# EAGLE design pga309 z bluetooth (EAGLE 5.06)

## Sheet 1 of 2
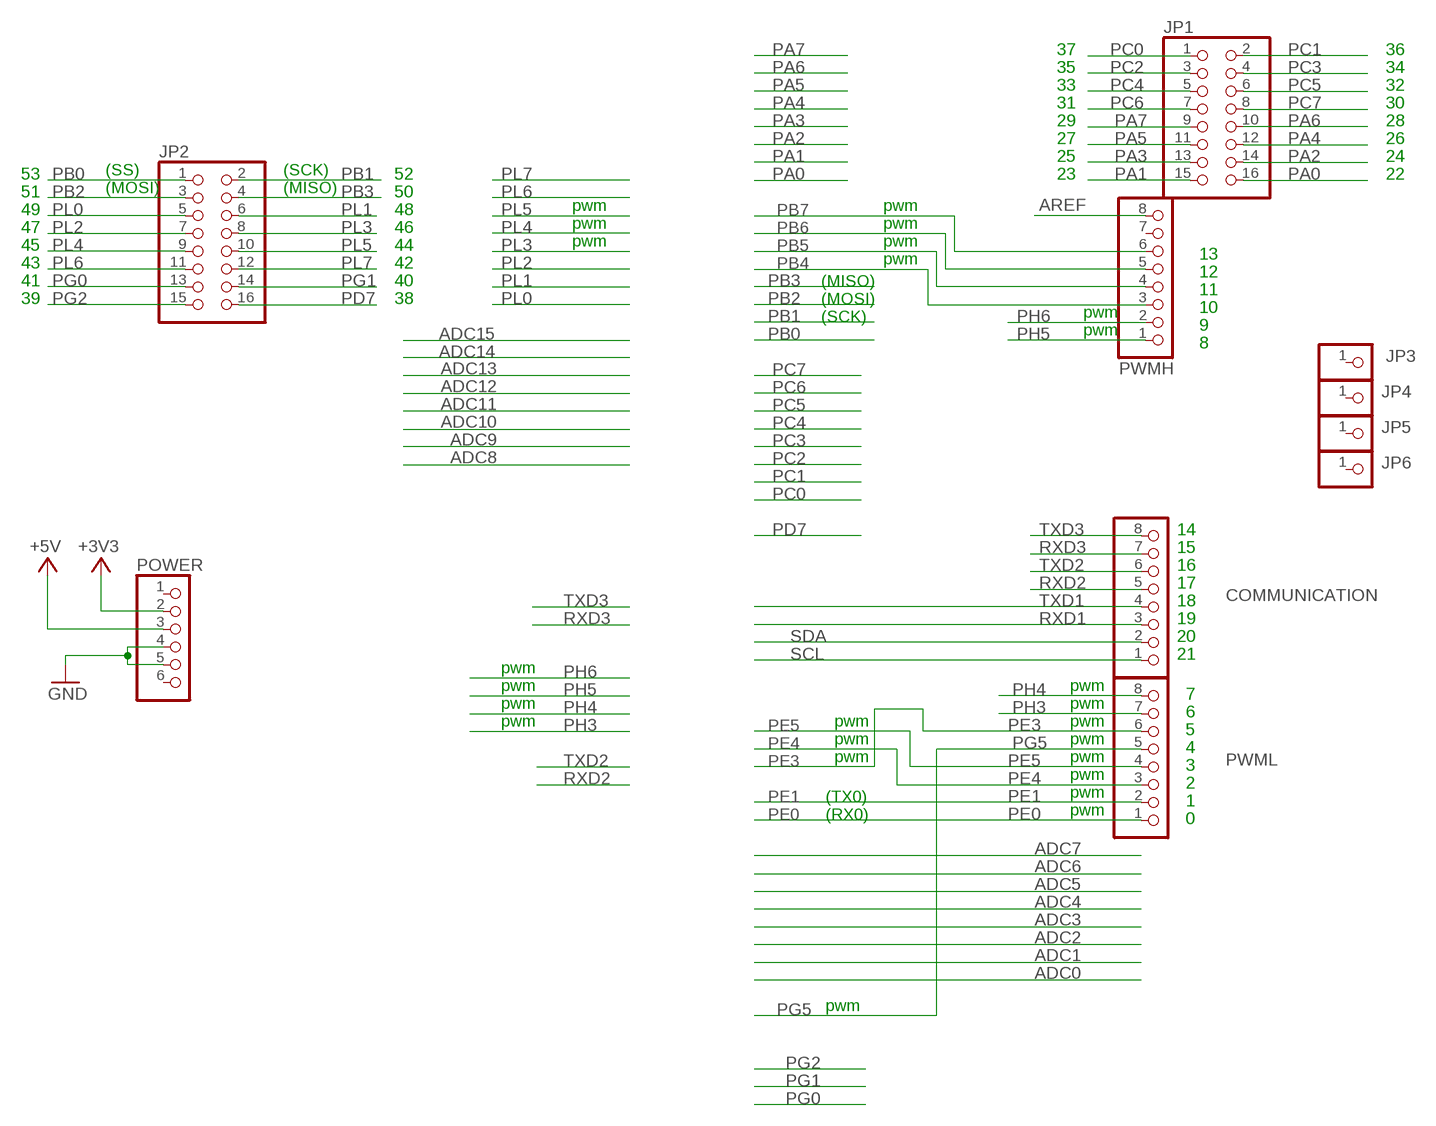
[diagram p0: schematic, sheet 1]

### Parts
COMMUNICATION  PINHD-1X8  [1X08]
JP1  PINHD-2X8  [2X08]
JP2  PINHD-2X8  [2X08]
JP3  PINHD-1X1  [1X01]
JP4  PINHD-1X1  [1X01]
JP5  PINHD-1X1  [1X01]
JP6  PINHD-1X1  [1X01]
POWER  PINHD-1X6  [1X06]
PWMH  PINHD-1X8  [1X08]
PWML  PINHD-1X8  [1X08]

### Nets
+3V3 [power]: POWER.2 ; also sheet 2
AREF: PWMH.8
GND [gnd]: POWER.4 POWER.5 ; also sheet 2
N$25: POWER.3 ; supply symbol labelled +5V ; also sheet 2
PA0: JP1.16
PA1: JP1.15
PA2: JP1.14
PA3: JP1.13
PA4: JP1.12
PA5: JP1.11
PA6: JP1.10
PA7: JP1.9
PB0: JP2.1
PB1: JP2.2 ; also sheet 2
PB2: JP2.3
PB3: JP2.4 ; also sheet 2
PB4: PWMH.3
PB5: PWMH.4
PB6: PWMH.5
PB7: PWMH.6
PC0: JP1.1
PC1: JP1.2
PC2: JP1.3
PC3: JP1.4
PC4: JP1.5
PC5: JP1.6
PC6: JP1.7
PC7: JP1.8
PD7: JP2.16
PE0: PWML.1
PE1: PWML.2
PE3: PWML.6
PE4: PWML.3
PE5: PWML.4
PG0: JP2.13
PG1: JP2.14
PG2: JP2.15
PG5: PWML.5
PH3: PWML.7
PH4: PWML.8
PH5: PWMH.1
PH6: PWMH.2
PL0: JP2.5
PL1: JP2.6 ; also sheet 2
PL2: JP2.7
PL3: JP2.8
PL4: JP2.9
PL5: JP2.10
PL6: JP2.11
PL7: JP2.12
RXD1: COMMUNICATION.3 ; also sheet 2
RXD2: COMMUNICATION.5
RXD3: COMMUNICATION.7
SCL: COMMUNICATION.1 ; also sheet 2
SDA: COMMUNICATION.2 ; also sheet 2
TXD1: COMMUNICATION.4 ; also sheet 2
TXD2: COMMUNICATION.6
TXD3: COMMUNICATION.8
Unconnected: JP3.1 JP4.1 JP5.1 JP6.1 POWER.1 POWER.6 PWMH.7

### Notes on the sheet
- 37 | 36
- 35 | 34
- 33 | 32
- 31 | 30
- 29 | 28
- 27 | 26
- 25 | 24
- 53 | (SS) | (SCK) | 52 | 23 | 22
- 51 | (MOSI) | (MISO) | 50
- 49 | 48 | pwm | pwm
- 47 | 46 | pwm | pwm
- 45 | 44 | pwm | pwm
- pwm | 13
- 43 | 42
- 12
- 41 | 40 | (MISO)
- 11
- 39 | 38 | (MOSI)
- pwm | 10
- (SCK)
- pwm | 9
- 8
- 14
- 15
- 16
- 17
- 18
- 19
- 20
- 21
- pwm
- pwm | pwm
- 7
- pwm | pwm
- 6
- pwm | pwm | pwm
- 5
- pwm | pwm
- 4
- pwm | pwm
- 3
- pwm
- 2
- (TX0) | pwm
- 1
- (RX0) | pwm
- 0
- pwm

## Sheet 2 of 2
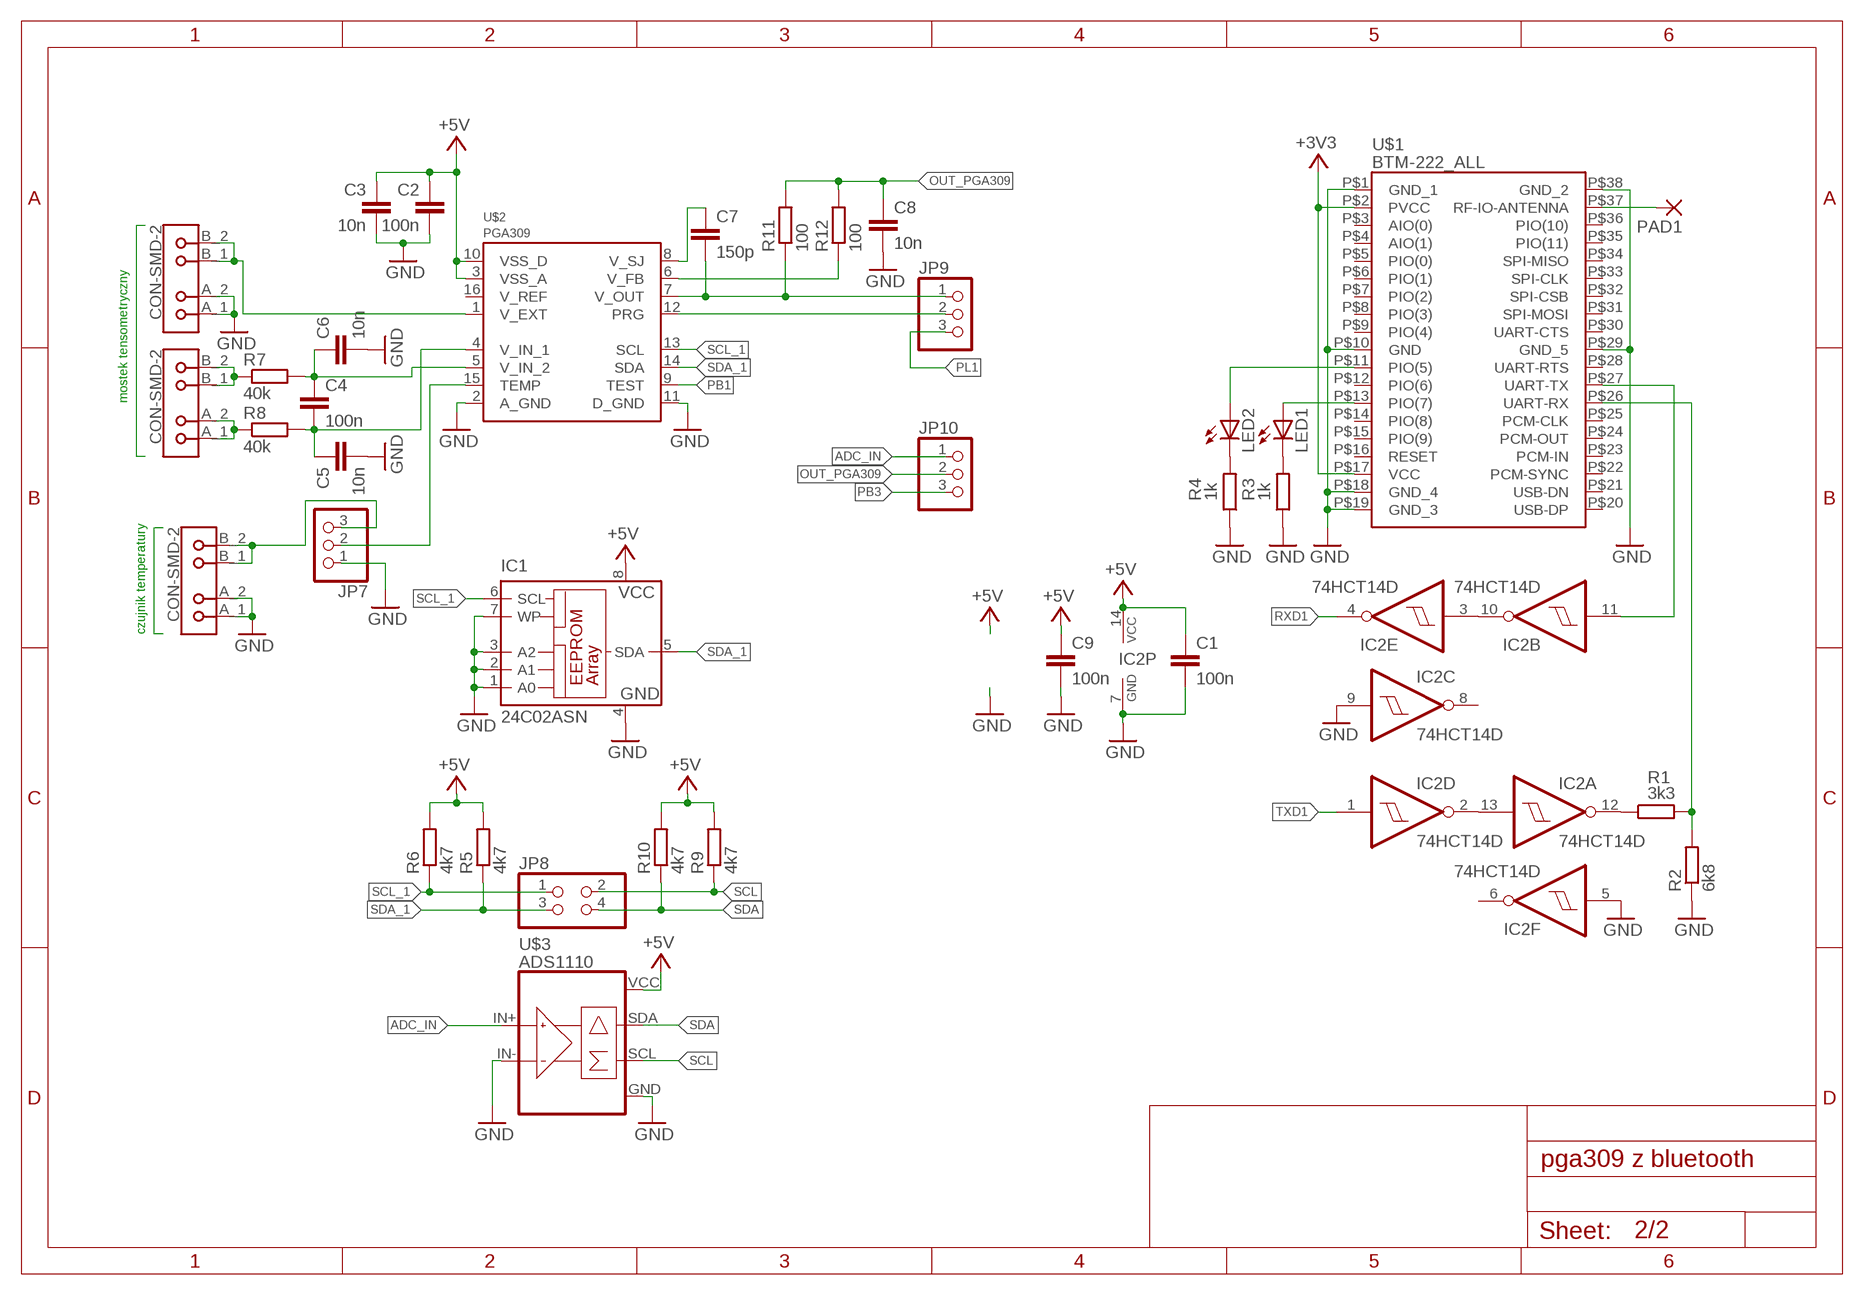
[diagram p1: schematic, sheet 2]

### Parts
C1  100n  C-EUC0805  [C0805]
C2  100n  C-EUC0805  [C0805]
C3  10n  C-EUC0805  [C0805]
C4  100n  C-EUC0805  [C0805]
C5  10n  C-EUC0805  [C0805]
C6  10n  C-EUC0805  [C0805]
C7  150p  C-EUC1206  [C1206]
C8  10n  C-EUC0805  [C0805]
C9  100n  C-EUC0805  [C0805]
IC1  24C02ASN  [SO-08]
IC2  74HCT14D  74AC14D  [SO14]
JP7  PINHD-1X3_2.54-SMD  [1X03SMD]
JP8  PINHD-2X2_2.54-SMD  [2X02SMD]
JP9  PINHD-1X3_2.54-SMD  [1X03SMD]
JP10  PINHD-1X3_2.54-SMD  [1X03SMD]
LED1  LEDCHIPLED_0805  [CHIPLED_0805]
LED2  LEDCHIPLED_0805  [CHIPLED_0805]
PAD1  SMD2  [SMD1,27-2,54]
R1  3k3  R-EU_R0805  [R0805]
R2  6k8  R-EU_R0805  [R0805]
R3  1k  R-EU_R0805  [R0805]
R4  1k  R-EU_R0805  [R0805]
R5  4k7  R-EU_R0805  [R0805]
R6  4k7  R-EU_R0805  [R0805]
R7  40k  R-EU_R1206  [R1206]
R8  40k  R-EU_R1206  [R1206]
R9  4k7  R-EU_R0805  [R0805]
R10  4k7  R-EU_R0805  [R0805]
R11  100  R-EU_R1206  [R1206]
R12  100  R-EU_R1206  [R1206]
U$1  BTM-222_ALL  [BTM-222]
U$2  PGA309  [TSSOP16]
U$3  ADS1110  [SOT23-6]
U$4  CON-SMD-2  [CON-SMD_2_PIN]
U$5  CON-SMD-2  [CON-SMD_2_PIN]
U$6  CON-SMD-2  [CON-SMD_2_PIN]

### Nets
+3V3 [power]: U$1.P$2(PVCC) U$1.P$17(VCC) ; also sheet 1
ADC_IN: JP10.1 U$3.IN+
GND [gnd]: C1.2 C2.2 C3.2 C5.2 C6.2 C8.2 C9.2 IC1.1(A0) IC1.2(A1) IC1.3(A2) IC1.4(GND) IC1.7(WP) IC2.5(F:I) IC2.7(P:GND) IC2.9(C:I) JP7.1 R2.1 R3.1 R4.1 U$1.P$1(GND_1) U$1.P$10(GND) U$1.P$18(GND_4) U$1.P$19(GND_3) U$1.P$29(GND_5) U$1.P$38(GND_2) U$2.2(A_GND) U$2.11(D_GND) U$3.GND U$3.IN- U$4.A_1 U$4.A_2 U$6.A_1 U$6.A_2 ; also sheet 1
N$2: IC2.2(D:O) IC2.13(A:I)
N$4: IC2.3(E:I) IC2.10(B:O)
N$6: R7.1 U$5.B_1 U$5.B_2
N$7: IC2.12(A:O) R1.1
N$8: PAD1.1(P) U$1.P$37(RF-IO-ANTENNA)
N$9: LED1.A U$1.P$13(PIO(7))
N$10: LED2.A U$1.P$11(PIO(5))
N$11: LED1.C R3.2
N$12: LED2.C R4.2
N$13: R8.1 U$5.A_1 U$5.A_2
N$16: JP7.2 U$2.15(TEMP)
N$17: U$2.1(V_EXT) U$4.B_1 U$4.B_2
N$18: C4.2 C5.1 R8.2 U$2.4(V_IN_1)
N$19: C4.1 C6.1 R7.2 U$2.5(V_IN_2)
N$20: C7.2 JP9.1 R11.1 U$2.7(V_OUT)
N$21: JP7.3 U$6.B_1 U$6.B_2
N$22: JP9.2 U$2.12(PRG)
N$23: C7.1 U$2.8(V_SJ)
N$24: R12.1 U$2.6(V_FB)
N$25: C1.1 C2.1 C3.1 C9.1 IC1.8(VCC) IC2.14(P:VCC) R5.2 R6.2 R9.2 R10.2 U$2.3(VSS_A) U$2.10(VSS_D) U$3.VCC ; supply symbol labelled +5V ; also sheet 1
OUT_PGA309: C8.1 JP10.2 R11.2 R12.2
PB1: U$2.9(TEST) ; also sheet 1
PB3: JP10.3 ; also sheet 1
PL1: JP9.3 ; also sheet 1
RXD1: IC2.4(E:O) ; also sheet 1
SCL: JP8.2 R9.1 U$3.SCL ; also sheet 1
SCL_1: IC1.6(SCL) JP8.1 R6.1 U$2.13(SCL)
SDA: JP8.4 R10.1 U$3.SDA ; also sheet 1
SDA_1: IC1.5(SDA) JP8.3 R5.1 U$2.14(SDA)
TXD1: IC2.1(D:I) ; also sheet 1
UART-RX: R1.2 R2.2 U$1.P$26(UART-RX)
UART-TX: IC2.11(B:I) U$1.P$27(UART-TX)
Unconnected: IC2.6(F:O) IC2.8(C:O) U$1.P$3(AIO(0)) U$1.P$4(AIO(1)) U$1.P$5(PIO(0)) U$1.P$6(PIO(1)) U$1.P$7(PIO(2)) U$1.P$8(PIO(3)) U$1.P$9(PIO(4)) U$1.P$12(PIO(6)) U$1.P$14(PIO(8)) U$1.P$15(PIO(9)) U$1.P$16(RESET) U$1.P$20(USB-DP) U$1.P$21(USB-DN) U$1.P$22(PCM-SYNC) U$1.P$23(PCM-IN) U$1.P$24(PCM-OUT) U$1.P$25(PCM-CLK) U$1.P$28(UART-RTS) U$1.P$30(UART-CTS) U$1.P$31(SPI-MOSI) U$1.P$32(SPI-CSB) U$1.P$33(SPI-CLK) U$1.P$34(SPI-MISO) U$1.P$35(PIO(11)) U$1.P$36(PIO(10)) U$2.16(V_REF)

### Notes on the sheet
- mostek tensometryczny
- czujnik temperatury

## Library data of the parts
C1-C9 = rcl:C-EU: CAPACITOR, European symbol
COMMUNICATION PWMH PWML = pinhead:PINHD-1X8: PIN HEADER
IC1 = microchip:24C*: Serial EEPROM 1 K/2 K/4 K
IC2 = 74xx-eu:74*14: Hex schmitt trigger INVERTER
JP1 JP2 = pinhead:PINHD-2X8: PIN HEADER
JP3-JP6 = pinhead:PINHD-1X1: PIN HEADER
JP7 JP9 JP10 = pinhead-1:PINHD-1X3: PIN HEADER
JP8 = pinhead-1:PINHD-2X2: PIN HEADER
LED1 LED2 = led:LED: LED OSRAM: - CHIPLED LG R971, LG N971, LY N971, LG Q971, LY Q971, LO R971, LY R971 LH N974, LH R974 LS Q976, LO Q976, LY Q976 LO Q996 - Hyper CHIPLED LW Q18S LB Q993, LB Q99A, LB R99A - SideLED LS A670, LO A670, LY A670, LG A670, LP A670 LB A673, LV A673, LT A673, LW A673 LH A674 LY A675 LS A676, LA A676, LO A676, LY A676, LW A676 LS A679, LY A679, LG A679 - Hyper Micro SIDELED® LS Y876, LA Y876, LO Y876, LY Y876 LT Y87S - SmartLED LW L88C, LW L88S LB L89C, LB L89S, LG L890 LS L89K, LO L89K, LY L89K LS L896, LA L896, LO L896, LY L896 - TOPLED LS T670, LO T670, LY T670, LG T670, LP T670 LSG T670, LSP T670, LSY T670, LOP T670, LYG T670 LG T671, LOG T671, LSG T671 LB T673, LV T673, LT T673, LW T673 LH T674 LS T676, LA T676, LO T676, LY T676, LB T676, LH T676, LSB T676, LW T676 LB T67C, LV T67C, LT T67C, LS T67K, LO T67K, LY T67K, LW E67C LS E67B, LA E67B, LO E67B, LY E67B, LB E67C, LV E67C, LT E67C LW T67C LS T679, LY T679, LG T679 LS T770, LO T770, LY T770, LG T770, LP T770 LB T773, LV T773, LT T773, LW T773 LH T774 LS E675, LA E675, LY E675, LS T675 LS T776, LA T776, LO T776, LY T776, LB T776 LHGB T686 LT T68C, LB T68C - Hyper Mini TOPLED® LB M676 - Mini TOPLED Santana® LG M470 LS M47K, LO M47K, LY M47K Source: http://www.osram.convergy.de LUXEON: - LUMILED® LXK2-PW12-R00, LXK2-PW12-S00, LXK2-PW14-U00, LXK2-PW14-V00 LXK2-PM12-R00, LXK2-PM12-S00, LXK2-PM14-U00 LXK2-PE12-Q00, LXK2-PE12-R00, LXK2-PE12-S00, LXK2-PE14-T00, LXK2-PE14-U00 LXK2-PB12-K00, LXK2-PB12-L00, LXK2-PB12-M00, LXK2-PB14-N00, LXK2-PB14-P00, LXK2-PB14-Q00 LXK2-PR12-L00, LXK2-PR12-M00, LXK2-PR14-Q00, LXK2-PR14-R00 LXK2-PD12-Q00, LXK2-PD12-R00, LXK2-PD12-S00 LXK2-PH12-R00, LXK2-PH12-S00 LXK2-PL12-P00, LXK2-PL12-Q00, LXK2-PL12-R00 Source: www.luxeon.com KINGBRIGHT: KA-3528ASYC Source: www.kingbright.com
PAD1 = wirepad:SMD2: SMD PAD
POWER = pinhead:PINHD-1X6: PIN HEADER
R1-R12 = rcl:R-EU_: RESISTOR, European symbol
U$1 = BTM_222:BTM-222_ALL
U$2 = pga309:PGA309
U$3 = ads1110:ADS1110
U$4-U$6 = con-smd-2:CON-SMD-2

## Net classes
0 default: width 0.203 mm, drill 0.406 mm, clearance 0.203 mm
1 power: width 0.61 mm, drill 0.711 mm, clearance 0.203 mm
2 gnd: width 0.305 mm, drill 0.711 mm, clearance 0.203 mm
3 usbvcc: width 0.508 mm, drill 0.711 mm, clearance 0.203 mm

## Board
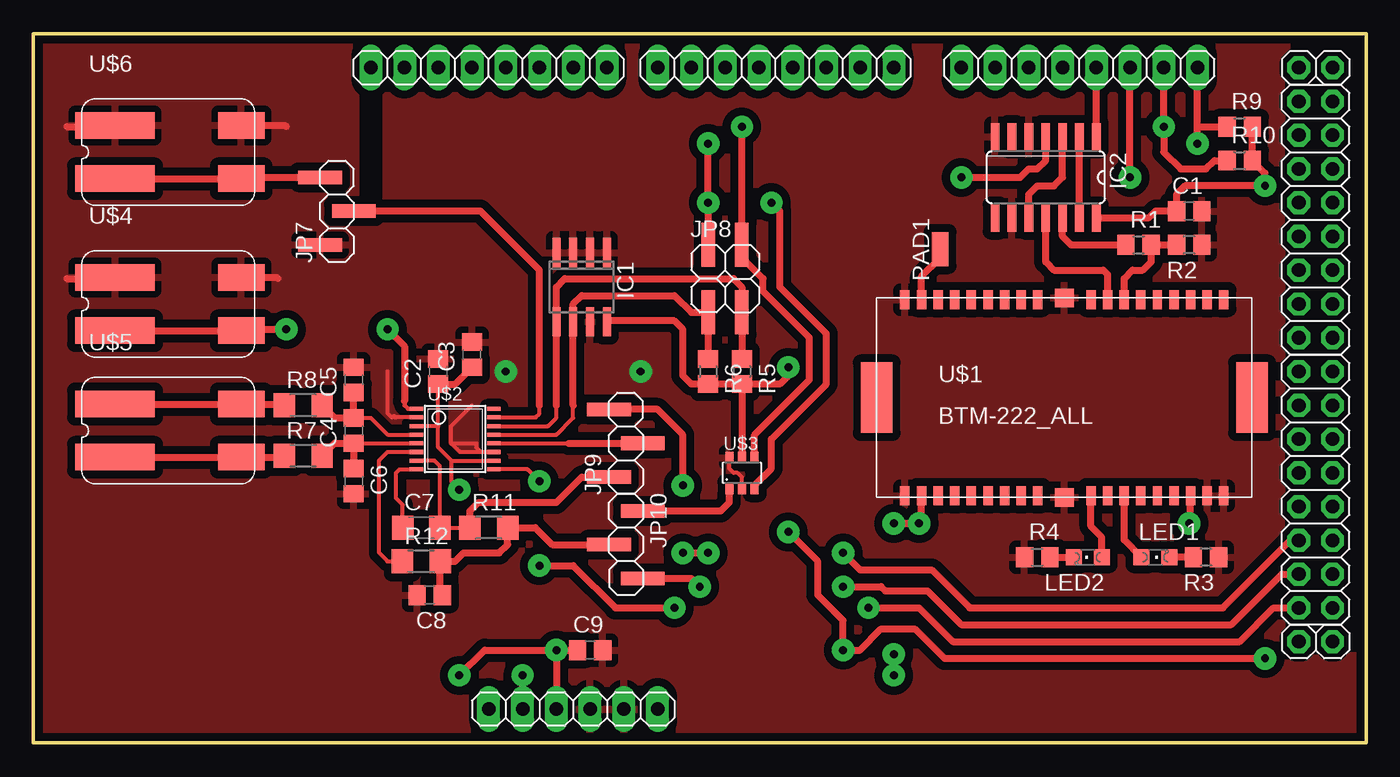
[diagram p2: board, top side]
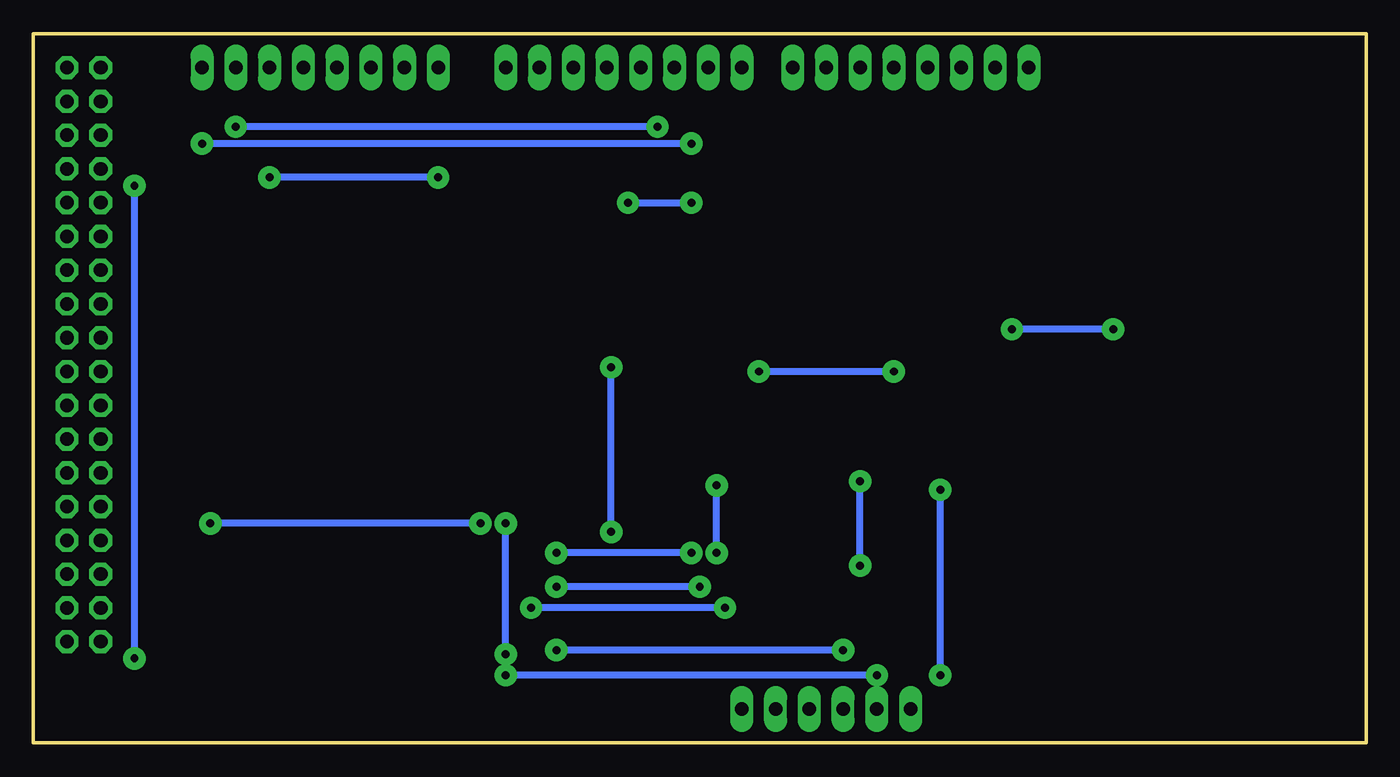
[diagram p3: board, bottom side, seen from below]

Size 100.33 x 53.34 mm. Coordinates in mm from the lower left corner, seen from the top.
Outline: 0,53.34 100.33,53.34 100.33,0 0,0 0,53.34
Copper layers (1*16): Top 0.035mm / dielectric 1.5mm / Bottom 0.035mm
Design rules "default *": minimum track width 8mil, minimum drill 16mil, track to track 8mil, track to pad 8mil, pad to pad 8mil, via to via 10mil, smd to smd 8mil, copper to edge 20mil, drill to drill 12mil, minimum pad ring 14mil, minimum via ring 10mil, stop-mask expansion 4mil, vias tented up to drill 0mil, thermal gap 20mil
tRestrict: 4 lines

### Footprints (pad centres in the part's own frame; a part is rotated, then mirrored left to right if it is on the bottom)
C0805 = smd 1.3 x 1.5: 1 -0.95,0; 2 0.95,0
C1206 = smd 1.6 x 1.8: 1 -1.4,0; 2 1.4,0
1X08 = drill 1.016 long: 1 -8.89,0; 2 -6.35,0; 3 -3.81,0; 4 -1.27,0; 5 1.27,0; 6 3.81,0; 7 6.35,0; 8 8.89,0
SO-08 = smd 0.6 x 2.2: 1 -1.905,-2.6; 2 -0.635,-2.6; 3 0.635,-2.6; 4 1.905,-2.6; 5 1.905,2.6; 6 0.635,2.6; 7 -0.635,2.6; 8 -1.905,2.6
SO14 = smd 0.66 x 2.032: 1 -3.81,-3.073; 2 -2.54,-3.073; 3 -1.27,-3.073; 4 0,-3.073; 5 1.27,-3.073; 6 2.54,-3.073; 7 3.81,-3.073; 8 3.81,3.073; 9 2.54,3.073; 10 1.27,3.073; 11 0,3.073; 12 -1.27,3.073; 13 -2.54,3.073; 14 -3.81,3.073
2X08 = drill 1.016 octagon: 1 -8.89,-1.27; 2 -8.89,1.27; 3 -6.35,-1.27; 4 -6.35,1.27; 5 -3.81,-1.27; 6 -3.81,1.27; 7 -1.27,-1.27; 8 -1.27,1.27; 9 1.27,-1.27; 10 1.27,1.27; 11 3.81,-1.27; 12 3.81,1.27; 13 6.35,-1.27; 14 6.35,1.27; 15 8.89,-1.27; 16 8.89,1.27
1X01 = drill 1.016 octagon: 1 0,0
1X03SMD = smd 1.016 x 3.302: 1 -1.27,1.27; 2 1.27,-1.27; 3 3.81,1.27
2X02SMD = smd 1.016 x 3.302: 1 -1.27,-3.81; 2 -1.27,1.27; 3 1.27,-3.81; 4 1.27,1.27
CHIPLED_0805 = smd 1.2 x 1.2: A 0,-1.05; C 0,1.05
SMD1,27-2,54 = smd 1.27 x 2.54: 1 0,0
1X06 = drill 1.016 long: 1 -6.35,0; 2 -3.81,0; 3 -1.27,0; 4 1.27,0; 5 3.81,0; 6 6.35,0
R0805 = smd 1.3 x 1.5: 1 -0.95,0; 2 0.95,0
R1206 = smd 1.6 x 1.803: 1 -1.422,0; 2 1.422,0
BTM-222 = smd 2.4 x 5.3: $AGND -14.625,3.75; $BGND 13.625,3.75 | smd 0.711 x 1.422: P$1 -12.5,-3.625; P$2 -11.25,-3.625; P$3 -10,-3.625; P$4 -8.75,-3.625; P$5 -7.5,-3.625; P$6 -6.25,-3.625; P$7 -5,-3.625; P$8 -3.75,-3.625; P$9 -2.5,-3.625; P$11 1.5,-3.625; P$12 2.75,-3.625; P$13 4,-3.625; P$14 5.25,-3.625; P$15 6.5,-3.625; P$16 7.75,-3.625; P$17 9,-3.625; P$18 10.25,-3.625; P$19 11.5,-3.625; P$20 11.5,11.125; P$21 10.25,11.125; P$22 9,11.125; P$23 7.75,11.125; P$24 6.5,11.125; P$25 5.25,11.125; P$26 4,11.125; P$27 2.75,11.125; P$28 1.5,11.125; P$30 -2.5,11.125; P$31 -3.75,11.125; P$32 -5,11.125; P$33 -6.25,11.125; P$34 -7.5,11.125; P$35 -8.75,11.125; P$36 -10,11.125; P$37 -11.25,11.125; P$38 -12.5,11.125 | smd 1.422 x 1.4: P$10 -0.5,-3.75; P$29 -0.5,11.25
TSSOP16 = smd 0.305 x 0.991: 1 -2.275,-2.918; 2 -1.625,-2.918; 3 -0.975,-2.918; 4 -0.325,-2.918; 5 0.325,-2.918; 6 0.975,-2.918; 7 1.625,-2.918; 8 2.275,-2.918; 9 2.275,2.918; 10 1.625,2.918; 11 0.975,2.918; 12 0.325,2.918; 13 -0.325,2.918; 14 -0.975,2.918; 15 -1.625,2.918; 16 -2.275,2.918
SOT23-6 = smd 0.6 x 0.9: GND 0,-1.15; IN+ -0.95,-1.15; IN- -0.95,1.15; SCL 0.95,-1.15; SDA 0.95,1.15; VCC 0,1.15
CON-SMD_2_PIN = smd 6 x 2: A_1 -4,2; B_1 -4,-2 | smd 3.5 x 2: A_2 5.5,2; B_2 5.5,-2

### Placement (x,y rotation side)
C1  86.99,40.01 0 top
C2  30.48,27.94 90 top
C3  33.02,29.21 90 top
C4  24.13,23.5 90 top
C5  24.13,27.3 90 top
C6  24.13,19.68 270 top
C7  29.21,16.19 0 top
C8  29.84,11.11 180 top
C9  41.91,6.99 0 top
COMMUNICATION  78.74,50.8 180 top
IC1  41.28,34.29 180 top
IC2  76.2,42.55 180 top
JP1  96.52,39.37 90 top
JP2  96.52,19.05 90 top
JP3  95.25,50.8 0 top
JP4  97.79,50.8 0 top
JP5  95.25,7.62 0 top
JP6  97.79,7.62 0 top
JP7  22.86,38.73 90 top
JP8  52.07,36.2 0 top
JP9  44.61,21.27 90 top
JP10  44.61,16.19 270 top
LED1  84.45,13.97 270 top
LED2  79.38,13.97 90 top
PAD1  68.26,37.15 0 top
POWER  40.64,2.54 0 top
PWMH  34.29,50.8 180 top
PWML  55.88,50.8 180 top
R1  83.19,37.47 0 top
R2  86.99,37.47 180 top
R3  88.27,13.97 180 top
R4  75.56,13.97 0 top
R5  53.34,27.94 270 top
R6  50.8,27.94 270 top
R7  20.32,21.59 0 top
R8  20.32,25.4 0 top
R9  90.8,46.35 0 top
R10  90.8,43.81 0 top
R11  34.29,16.19 0 top
R12  29.21,13.65 0 top
U$1  78.1,22.23 0 top
U$2  31.75,22.86 270 top
U$3  53.34,20.32 0 top
U$4  10.16,33.02 0 top
U$5  10.16,23.5 0 top
U$6  10.16,44.45 0 top

### Tracks (layer width: path | path; a pad name or v marks a point on that pad's centre or on a via)
+3V3  (via drill 0.6 pad 1.68)
  Top 0.508: U$1.P$2 66.85,16.69 v66.67,16.51 v64.77,16.51 | v86.99,16.51 87.1,16.62 U$1.P$17 | POWER.2 v36.83,5.08 | v64.77,5.08 v64.77,6.67
  Bottom 0.508: v66.67,16.51 v86.99,16.51 | v36.83,5.08 v64.77,5.08 | v64.77,6.67 v64.77,16.51
ADC_IN
  Top 0.508: JP10.1 51.75,17.46 52.39,18.1 U$3.IN+
GND  (via drill 0.6 pad 1.68)
  Top 0.305: 27.15,24.61 27.27,24.48 U$2.2 26.99,24.48 26.67,24.8 26.67,27.94 | U$3.GND 53.34,20 53.02,20.32 52.71,20.32 52.39,20.64 U$3.IN- | U$2.11 32.09,21.89 31.43,22.54 | 31.43,22.54 33.34,22.54 33.34,22.23 33.66,21.91 | 31.43,22.54 31.43,23.81 33.02,25.4
  Top 0.508: U$4.A_2 18.32,35.02 18.41,34.92 | U$6.A_2 18.95,46.45 19.05,46.35 | 2.54,34.92 5.71,34.92 6.35,35.56 | 2.54,46.35 5.71,46.35
  Bottom 0.508: v35.56,27.94 v45.72,27.94
  pour Top (isolate 0.61): 100.33,0 100.33,53.34 0,53.34 0,0
N$2
  Top 0.508: IC2.13 IC2.2
N$4
  Top 0.508: IC2.10 74.93,41.27 75.56,41.91 76.83,41.91 77.47,42.55 IC2.3
N$6
  Top 0.508: U$5.B_1 U$5.B_2 18.8,21.5 R7.1
N$7
  Top 0.508: R1.1 78.1,37.47 77.47,38.1 IC2.12
N$8
  Top 0.508: U$1.P$37 66.85,35.1 68.26,36.51 PAD1.1
N$9
  Top 0.508: U$1.P$13 82.1,15.27 LED1.A
N$10
  Top 0.508: U$1.P$11 79.6,16.28 80.42,15.46 LED2.A
N$11
  Top 0.508: R3.2 LED1.C
N$12
  Top 0.508: R4.2 LED2.C
N$13
  Top 0.508: U$5.A_1 U$5.A_2 | U$5.A_2 16.41,25.5 16.51,25.4 15.24,25.4 | U$5.A_2 18.8,25.5 R8.1
N$16
  Top 0.305: U$2.15 37.82,24.48 38.1,24.77 38.1,25.4
  Top 0.508: 38.1,25.4 38.1,35.56 33.66,40.01 JP7.2
N$17  (via drill 0.6 pad 1.68)
  Top 0.305: U$2.1 28.2,25.14 27.94,25.4 27.94,25.72
  Top 0.508: U$4.B_1 U$4.B_2 15.75,31.11 v19.05,31.11 | v26.67,31.11 27.94,29.84 27.94,25.72
  Bottom 0.508: v19.05,31.11 v26.67,31.11
N$18
  Top 0.305: U$2.4 26.66,23.18 25.4,24.45 C4.2
  Top 0.508: R8.2 22.7,24.45 C4.2 C5.1
N$19
  Top 0.305: U$2.5 24.14,22.54 C4.1
  Top 0.508: R7.2 22.7,22.55 C4.1 C6.1
N$20
  Top 0.305: U$2.7 30.2,21.23 30.61,20.82 C7.2 R11.1
  Top 0.508: JP9.1 41.28,20 39.37,18.1 33.5,18.1 32.87,17.46 R11.1
N$21
  Top 0.508: U$6.B_1 U$6.B_2 15.75,42.55 JP7.3
N$22
  Top 0.305: U$2.12 40.32,22.54
  Top 0.508: 40.32,22.54 JP9.2 | JP9.2
N$23
  Top 0.305: U$2.8 27.57,20.59 27.3,20.32 27.3,18.41 27.81,17.91 C7.1
N$24
  Top 0.305: U$2.6 26.67,21.89 26.04,21.25 26.04,14.29 26.67,13.65 R12.1
N$25  (via drill 0.6 pad 1.68)
  Top 0.305: 30.48,23.84 U$2.3 | 30.48,23.84 C2.1 | 31.47,21.23 30.48,22.23 30.48,23.84 | 31.47,21.23 31.47,19.65 v32.07,19.05 | 31.47,21.23 U$2.10
  Top 0.508: R9.2 R10.2 92.71,42.86 v92.71,41.91 86.68,41.91 86.05,41.27 C1.1 84.45,40.01 83.92,39.47 IC2.14 | v39.37,6.99 POWER.3 | v92.71,6.35 68.58,6.35 66.36,8.57 63.82,8.57 62.23,6.99 v60.96,6.99 60.96,9.21 59.05,11.11 59.05,13.65 v56.83,15.88 | R5.2 R6.2 49.53,26.99 48.9,27.62 48.9,31.11 48.26,31.75 43.24,31.75 IC1.8 | R5.2 | C2.1 31.75,26.99 C3.1 | R5.2 U$3.VCC | v56.83,28.26 56.83,27.62 56.2,26.99 R5.2 | v39.37,6.99 33.97,6.99 v32.07,5.08 | v39.37,6.99 C9.1
  Bottom 0.508: v92.71,6.35 v92.71,41.91 | v39.37,6.99 v60.96,6.99 | v32.07,5.08 v32.07,19.05 | v56.83,15.88 v56.83,28.26
OUT_PGA309
  Top 0.508: C8.1 30.63,11.28 R12.2 31.75,13.65 32.38,14.29 35.08,14.29 35.71,14.92 R11.2 | R11.2 35.56,16.04 | JP10.2 39.05,14.92 37.78,16.19 R11.2
PB1  (via drill 0.6 pad 1.68)
  Top 0.305: U$2.9 37.2,20.59 v38.1,19.68
  Top 0.508: JP2.2 93.34,10.16 90.8,7.62 69.21,7.62 66.67,10.16 v62.87,10.16 | v38.1,13.34 40.64,13.34 43.82,10.16 v48.26,10.16
  Bottom 0.508: v38.1,13.34 v38.1,19.68 | v48.26,10.16 v62.87,10.16
PB3  (via drill 0.6 pad 1.68)
  Top 0.508: JP2.4 93.98,12.7 90.17,8.89 69.85,8.89 67.31,11.43 64.14,11.43 63.82,11.75 v60.96,11.75 | v50.17,11.75 49.53,12.38 JP10.3
  Bottom 0.508: v50.17,11.75 v60.96,11.75
PL1  (via drill 0.6 pad 1.68)
  Top 0.508: JP2.6 94.61,15.24 89.53,10.16 70.48,10.16 67.63,13.02 62.23,13.02 v60.96,14.29 | JP9.3 46.99,25.08 48.9,23.18 v48.9,19.37 | v48.9,14.29 v50.8,14.29
  Bottom 0.508: v48.9,14.29 v48.9,19.37 | v50.8,14.29 v60.96,14.29
RXD1  (via drill 0.6 pad 1.68)
  Top 0.508: IC2.4 76.2,43.81 75.56,43.18 74.93,43.18 74.3,42.55 v69.85,42.55 | v82.55,42.55 COMMUNICATION.3
  Bottom 0.508: v69.85,42.55 v82.55,42.55
SCL  (via drill 0.6 pad 1.68)
  Top 0.508: v50.8,45.09 v50.8,40.64 JP8.2 | 87.63,46.35 R9.1 | 87.63,46.35 COMMUNICATION.1 | v87.63,45.09 87.63,46.35 | U$3.SCL 54.29,19.36 55.56,20.64 55.56,22.86 59.69,26.99 59.69,30.8 56.2,34.29 56.2,40.01 v55.56,40.64
  Bottom 0.508: v50.8,45.09 v87.63,45.09 | v55.56,40.64 v50.8,40.64
SCL_1
  Top 0.305: U$2.13 39.37,23.18 40.64,24.45 40.64,25.4
  Top 0.508: R6.1 JP8.1 49.53,32.38 48.26,33.66 41.28,33.66 40.64,33.02 IC1.6 40.64,25.4
SDA  (via drill 0.6 pad 1.68)
  Top 0.508: COMMUNICATION.2 v85.09,46.35 85.09,44.45 86.36,43.18 88.27,43.18 88.9,43.81 R10.1 | v53.34,46.35 JP8.4 53.34,36.51 54.93,34.92 54.93,33.97 58.42,30.48 58.42,27.3 54.29,23.18 U$3.SDA
  Bottom 0.508: v53.34,46.35 v85.09,46.35
SDA_1
  Top 0.305: U$2.14 38.74,23.84 39.37,24.47 39.37,25.4
  Top 0.508: R5.1 JP8.3 53.34,34.29 52.71,34.92 40.01,34.92 39.37,34.29 IC1.5 39.37,25.4
TXD1
  Top 0.508: IC2.1 COMMUNICATION.4
UART-RX
  Top 0.508: R2.2 R1.2 84.13,36.2 83.5,35.56 82.74,35.56 82.1,34.92 U$1.P$26
UART-TX
  Top 0.508: U$1.P$27 80.85,35.24 80.54,35.56 76.83,35.56 76.2,36.2 IC2.11